# EAGLE design uzed-hmdi-test (EAGLE 8.6.1)

## Sheet 1 of 2
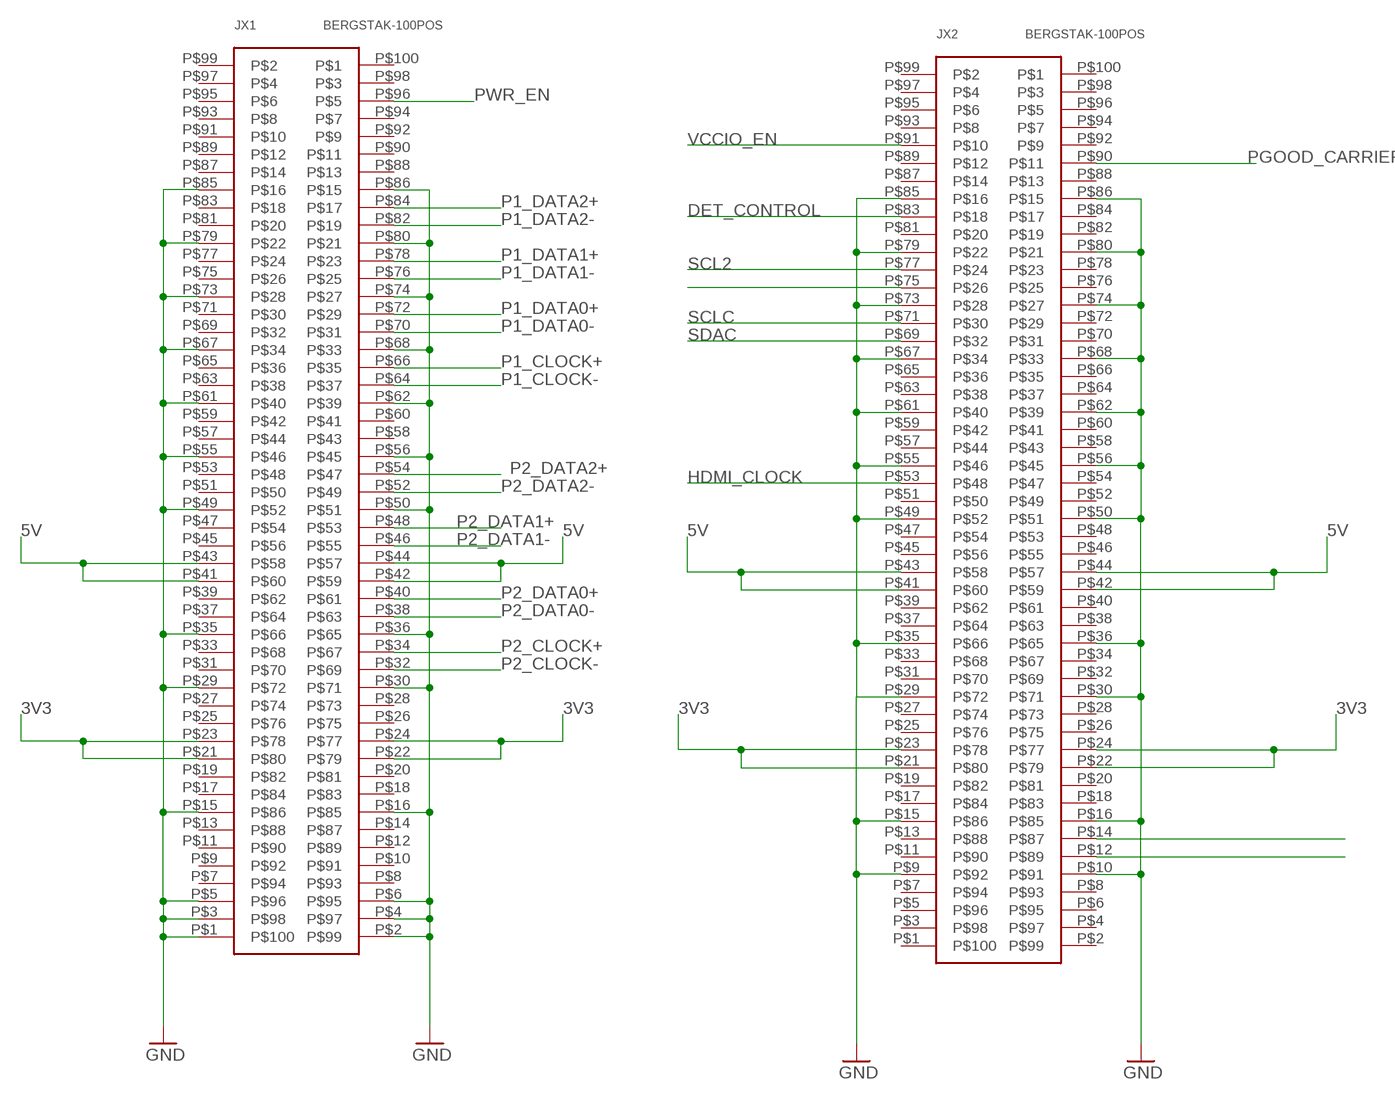
[diagram p0: schematic, sheet 1]

### Parts
JX1  BERGSTAK-100POS  [BERG100POS]
JX2  BERGSTAK-100POS  [BERG100POS]

### Nets
3V3: JX1.P$21 JX1.P$22 JX1.P$23 JX1.P$24 JX2.P$21 JX2.P$22 JX2.P$23 JX2.P$24 ; also sheet 2
5V: JX1.P$41 JX1.P$42 JX1.P$43 JX1.P$44 JX2.P$41 JX2.P$42 JX2.P$43 JX2.P$44 ; also sheet 2
DET_CONTROL: JX2.P$83 ; also sheet 2
GND: JX1.P$1 JX1.P$2 JX1.P$3 JX1.P$4 JX1.P$5 JX1.P$6 JX1.P$15 JX1.P$16 JX1.P$29 JX1.P$30 JX1.P$35 JX1.P$36 JX1.P$49 JX1.P$50 JX1.P$55 JX1.P$56 JX1.P$61 JX1.P$62 JX1.P$67 JX1.P$68 JX1.P$73 JX1.P$74 JX1.P$79 JX1.P$80 JX1.P$85 JX1.P$86 JX2.P$9 JX2.P$10 JX2.P$15 JX2.P$16 JX2.P$29 JX2.P$30 JX2.P$35 JX2.P$36 JX2.P$49 JX2.P$50 JX2.P$55 JX2.P$56 JX2.P$61 JX2.P$62 JX2.P$67 JX2.P$68 JX2.P$73 JX2.P$74 JX2.P$79 JX2.P$80 JX2.P$85 JX2.P$86 ; also sheet 2
HDMI_CLOCK: JX2.P$53 ; also sheet 2
N$2: JX2.P$14
N$3: JX2.P$12
P1_CLOCK+: JX1.P$66 ; also sheet 2
P1_CLOCK-: JX1.P$64 ; also sheet 2
P1_DATA0+: JX1.P$72 ; also sheet 2
P1_DATA0-: JX1.P$70 ; also sheet 2
P1_DATA1+: JX1.P$78 ; also sheet 2
P1_DATA1-: JX1.P$76 ; also sheet 2
P1_DATA2+: JX1.P$84 ; also sheet 2
P1_DATA2-: JX1.P$82 ; also sheet 2
P2_CLOCK+: JX1.P$34 ; also sheet 2
P2_CLOCK-: JX1.P$32 ; also sheet 2
P2_DATA0+: JX1.P$40 ; also sheet 2
P2_DATA0-: JX1.P$38 ; also sheet 2
P2_DATA1+: JX1.P$48 ; also sheet 2
P2_DATA1-: JX1.P$46 ; also sheet 2
P2_DATA2+: JX1.P$54 ; also sheet 2
P2_DATA2-: JX1.P$52 ; also sheet 2
PGOOD_CARRIER: JX2.P$90
PWR_EN: JX1.P$96
SCL2: JX2.P$77 ; also sheet 2
SCLC: JX2.P$71 ; also sheet 2
SDA2: JX2.P$75 ; also sheet 2
SDAC: JX2.P$69 ; also sheet 2
VCCIO_EN: JX2.P$91
Unconnected: JX1.P$7 JX1.P$8 JX1.P$9 JX1.P$10 JX1.P$11 JX1.P$12 JX1.P$13 JX1.P$14 JX1.P$17 JX1.P$18 JX1.P$19 JX1.P$20 JX1.P$25 JX1.P$26 JX1.P$27 JX1.P$28 JX1.P$31 JX1.P$33 JX1.P$37 JX1.P$39 JX1.P$45 JX1.P$47 JX1.P$51 JX1.P$53 JX1.P$57 JX1.P$58 JX1.P$59 JX1.P$60 JX1.P$63 JX1.P$65 JX1.P$69 JX1.P$71 JX1.P$75 JX1.P$77 JX1.P$81 JX1.P$83 JX1.P$87 JX1.P$88 JX1.P$89 JX1.P$90 JX1.P$91 JX1.P$92 JX1.P$93 JX1.P$94 JX1.P$95 JX1.P$97 JX1.P$98 JX1.P$99 JX1.P$100 JX2.P$1 JX2.P$2 JX2.P$3 JX2.P$4 JX2.P$5 JX2.P$6 JX2.P$7 JX2.P$8 JX2.P$11 JX2.P$13 JX2.P$17 JX2.P$18 JX2.P$19 JX2.P$20 JX2.P$25 JX2.P$26 JX2.P$27 JX2.P$28 JX2.P$31 JX2.P$32 JX2.P$33 JX2.P$34 JX2.P$37 JX2.P$38 JX2.P$39 JX2.P$40 JX2.P$45 JX2.P$46 JX2.P$47 JX2.P$48 JX2.P$51 JX2.P$52 JX2.P$54 JX2.P$57 JX2.P$58 JX2.P$59 JX2.P$60 JX2.P$63 JX2.P$64 JX2.P$65 JX2.P$66 JX2.P$70 JX2.P$72 JX2.P$76 JX2.P$78 JX2.P$81 JX2.P$82 JX2.P$84 JX2.P$87 JX2.P$88 JX2.P$89 JX2.P$92 JX2.P$93 JX2.P$94 JX2.P$95 JX2.P$96 JX2.P$97 JX2.P$98 JX2.P$99 JX2.P$100

## Sheet 2 of 2
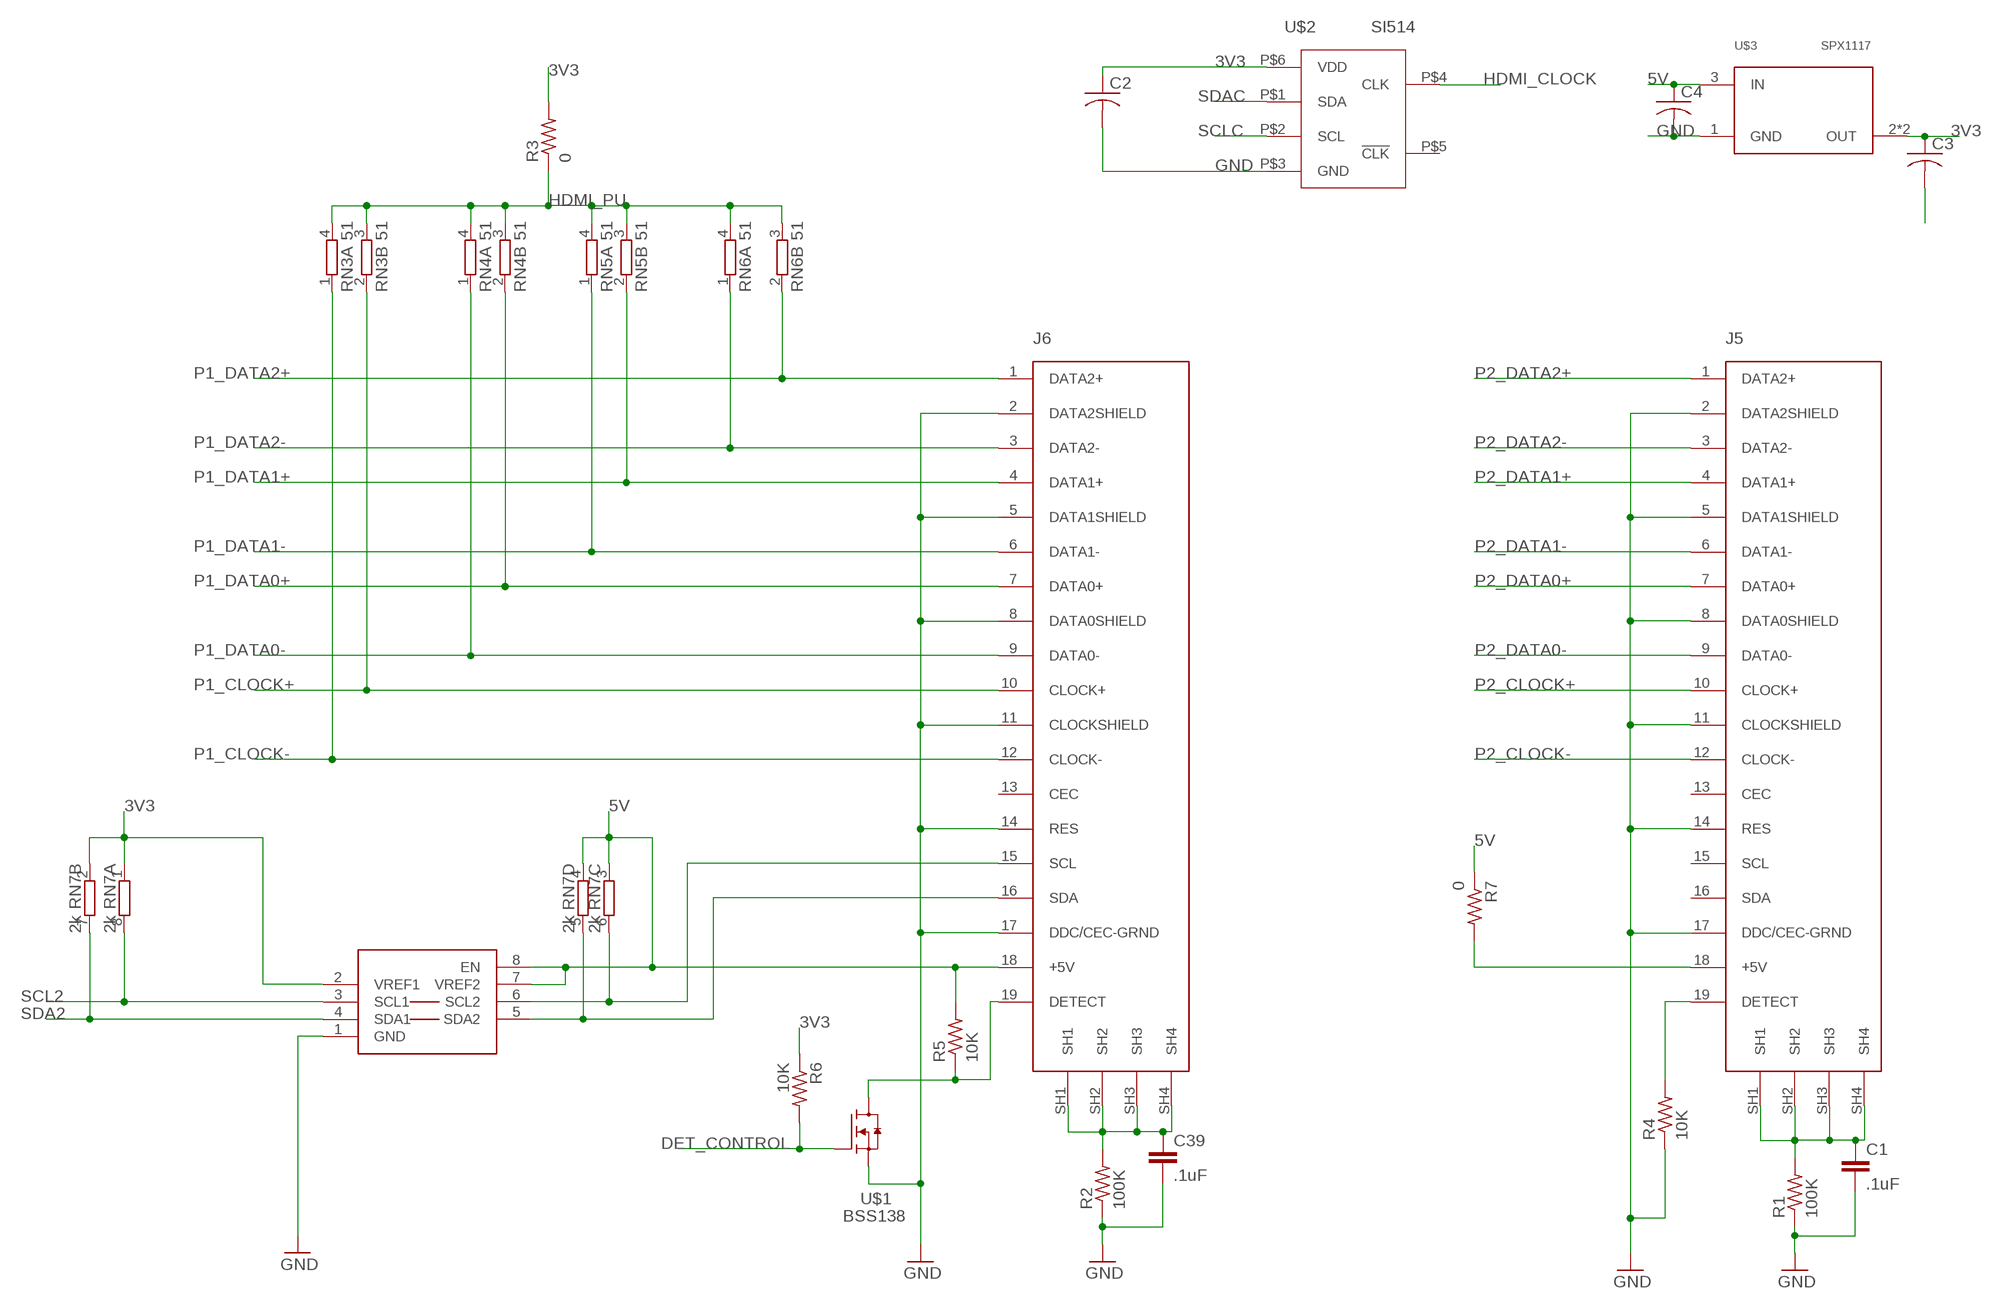
[diagram p1: schematic, sheet 2]

### Parts
C1  .1uF  C-EUC0603K  [C0603K]
C2  C-USC0603  [C0603]
C3  C-USC0603  [C0603]
C4  C-USC0603  [C0603]
C39  .1uF  C-EUC0603K  [C0603K]
J5  HDMI-TYPE-A-RECEPTICALFCI10029449  [FCI-HDMI-TYPE-A-RECEPT]
J6  HDMI-TYPE-A-RECEPTICALFCI10029449  [FCI-HDMI-TYPE-A-RECEPT]
PCA9306  PCA9306  [PSOP-8]
R1  100K  R-US_R0603  [R0603]
R2  100K  R-US_R0603  [R0603]
R3  0  R-US_R0603  [R0603]
R4  10K  R-US_R0603  [R0603]
R5  10K  R-US_R0603  [R0603]
R6  10K  R-US_R0603  [R0603]
R7  0  R-US_R0603  [R0603]
RN3  51  2R-NEXB34V  [EXB34V]
RN4  51  2R-NEXB34V  [EXB34V]
RN5  51  2R-NEXB34V  [EXB34V]
RN6  51  2R-NEXB34V  [EXB34V]
RN7  2k  4R-N0603-ARV  [0603-ARV]
U$1  BSS138  [SOT23]
U$2  SI514  [XTAL-6PIN]
U$3  SPX1117  [SOT223]

### Nets
3V3: C2.1 C3.1 PCA9306.2(VREF1) R3.2 R6.1 RN7.1 RN7.2 U$2.P$6(VDD) U$3.2(OUT) U$3.4(OUT) ; also sheet 1
5V: C4.1 J6.18(+5V) PCA9306.7(VREF2) PCA9306.8(EN) R5.2 R7.1 RN7.3 RN7.4 U$3.3(IN) ; also sheet 1
DET_CONTROL: R6.2 U$1.1(G) ; also sheet 1
GND: C1.2 C2.2 C3.2 C4.2 C39.2 J5.2(DATA2SHIELD) J5.5(DATA1SHIELD) J5.8(DATA0SHIELD) J5.11(CLOCKSHIELD) J5.14(RES) J5.17(DDC/CEC-GRND) J6.2(DATA2SHIELD) J6.5(DATA1SHIELD) J6.8(DATA0SHIELD) J6.11(CLOCKSHIELD) J6.14(RES) J6.17(DDC/CEC-GRND) PCA9306.1(GND) R1.1 R2.1 R4.1 U$1.2(S) U$2.P$3(GND) U$3.1(GND) ; also sheet 1
HDMI_CLOCK: U$2.P$4(CLK) ; also sheet 1
HDMI_PU: R3.1 RN3.3 RN3.4 RN4.3 RN4.4 RN5.3 RN5.4 RN6.3 RN6.4
N$1: C1.1 J5.SH1 J5.SH2 J5.SH3 J5.SH4 R1.2
N$10: J5.19(DETECT) R4.2
N$12: J6.19(DETECT) R5.1 U$1.3(D)
N$14: J5.18(+5V) R7.2
N$15: J6.16(SDA) PCA9306.5(SDA2) RN7.5
N$16: J6.15(SCL) PCA9306.6(SCL2) RN7.6
N$34: C39.1 J6.SH1 J6.SH2 J6.SH3 J6.SH4 R2.2
P1_CLOCK+: J6.10(CLOCK+) RN3.2 ; also sheet 1
P1_CLOCK-: J6.12(CLOCK-) RN3.1 ; also sheet 1
P1_DATA0+: J6.7(DATA0+) RN4.2 ; also sheet 1
P1_DATA0-: J6.9(DATA0-) RN4.1 ; also sheet 1
P1_DATA1+: J6.4(DATA1+) RN5.2 ; also sheet 1
P1_DATA1-: J6.6(DATA1-) RN5.1 ; also sheet 1
P1_DATA2+: J6.1(DATA2+) RN6.2 ; also sheet 1
P1_DATA2-: J6.3(DATA2-) RN6.1 ; also sheet 1
P2_CLOCK+: J5.10(CLOCK+) ; also sheet 1
P2_CLOCK-: J5.12(CLOCK-) ; also sheet 1
P2_DATA0+: J5.7(DATA0+) ; also sheet 1
P2_DATA0-: J5.9(DATA0-) ; also sheet 1
P2_DATA1+: J5.4(DATA1+) ; also sheet 1
P2_DATA1-: J5.6(DATA1-) ; also sheet 1
P2_DATA2+: J5.1(DATA2+) ; also sheet 1
P2_DATA2-: J5.3(DATA2-) ; also sheet 1
SCL2: PCA9306.3(SCL1) RN7.8 ; also sheet 1
SCLC: U$2.P$2(SCL) ; also sheet 1
SDA2: PCA9306.4(SDA1) RN7.7 ; also sheet 1
SDAC: U$2.P$1(SDA) ; also sheet 1
Unconnected: J5.13(CEC) J5.15(SCL) J5.16(SDA) J6.13(CEC) U$2.P$5(!CLK)

## Library data of the parts
C1 C39 = rcl:C-EU: CAPACITOR, European symbol
C2-C4 = rcl:C-US: CAPACITOR, American symbol; SPICEPREFIX: C
J5 J6 = saanlima:HDMI-TYPE-A-RECEPTICAL
JX1 JX2 = lupa300-components:BERGSTAK-100POS
PCA9306 = saanlima:PCA9306
R1 R2 R4-R7 = rcl:R-US_: RESISTOR, American symbol
R3 = rcl:R-US_: RESISTOR, American symbol; SPICEPREFIX: R
RN3-RN6 = resistor-dil:2R-N: Array Chip Resistor Source: Panasonic; OC_FARNELL: unknown; OC_NEWARK: unknown
RN7 = resistor-dil:4R-N: Array Chip Resistor Source: RS Component / Phycomp; OC_FARNELL: unknown; OC_NEWARK: unknown
U$1 = lupa300-components:BSS138: N-Channel 50V 220mA (Ta) 360mW (Ta) Surface Mount SOT-23-3
U$2 = lupa300-components:SI514
U$3 = lupa300-components:SPX1117: IC REG LINEAR 3.3V 800MA SOT223

## Board
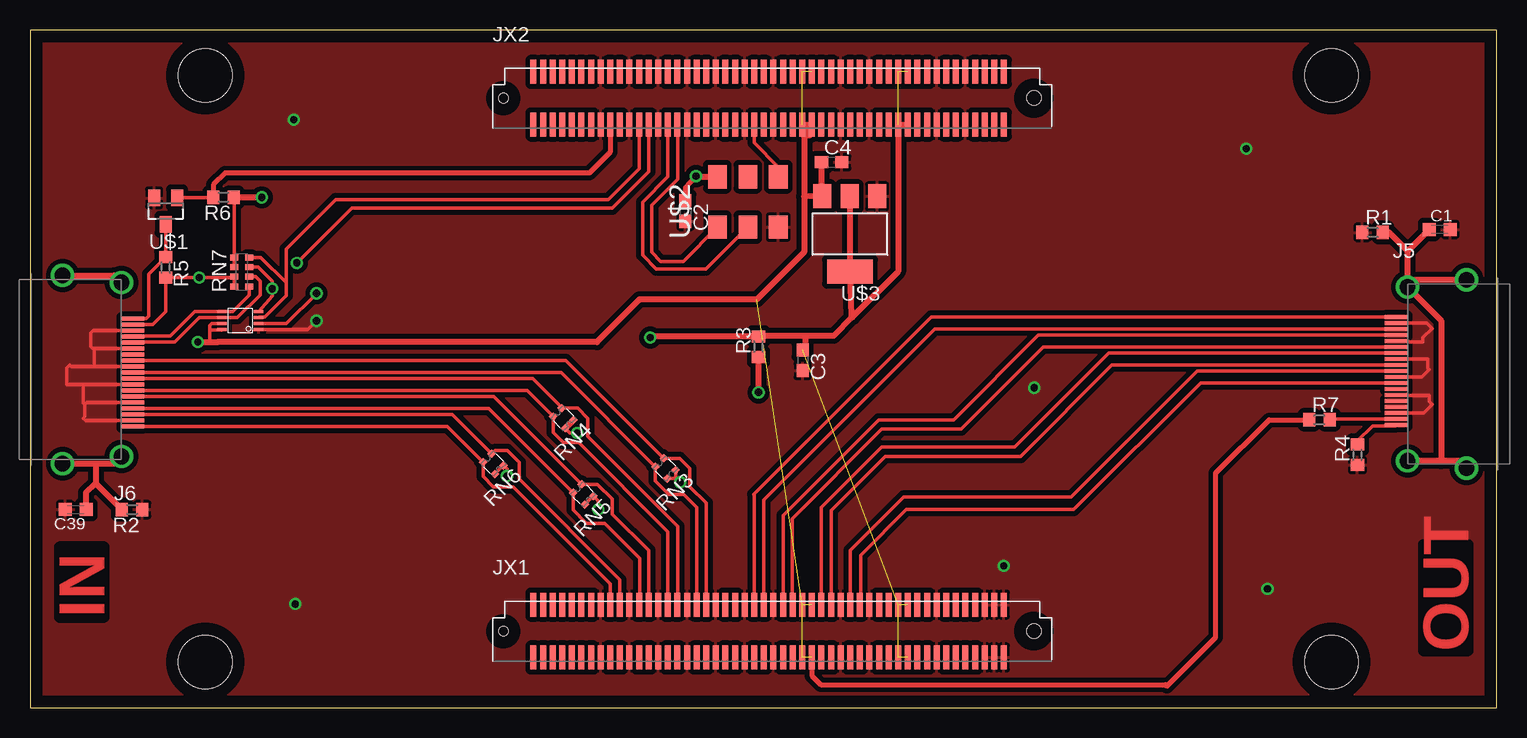
[diagram p2: board, top side]
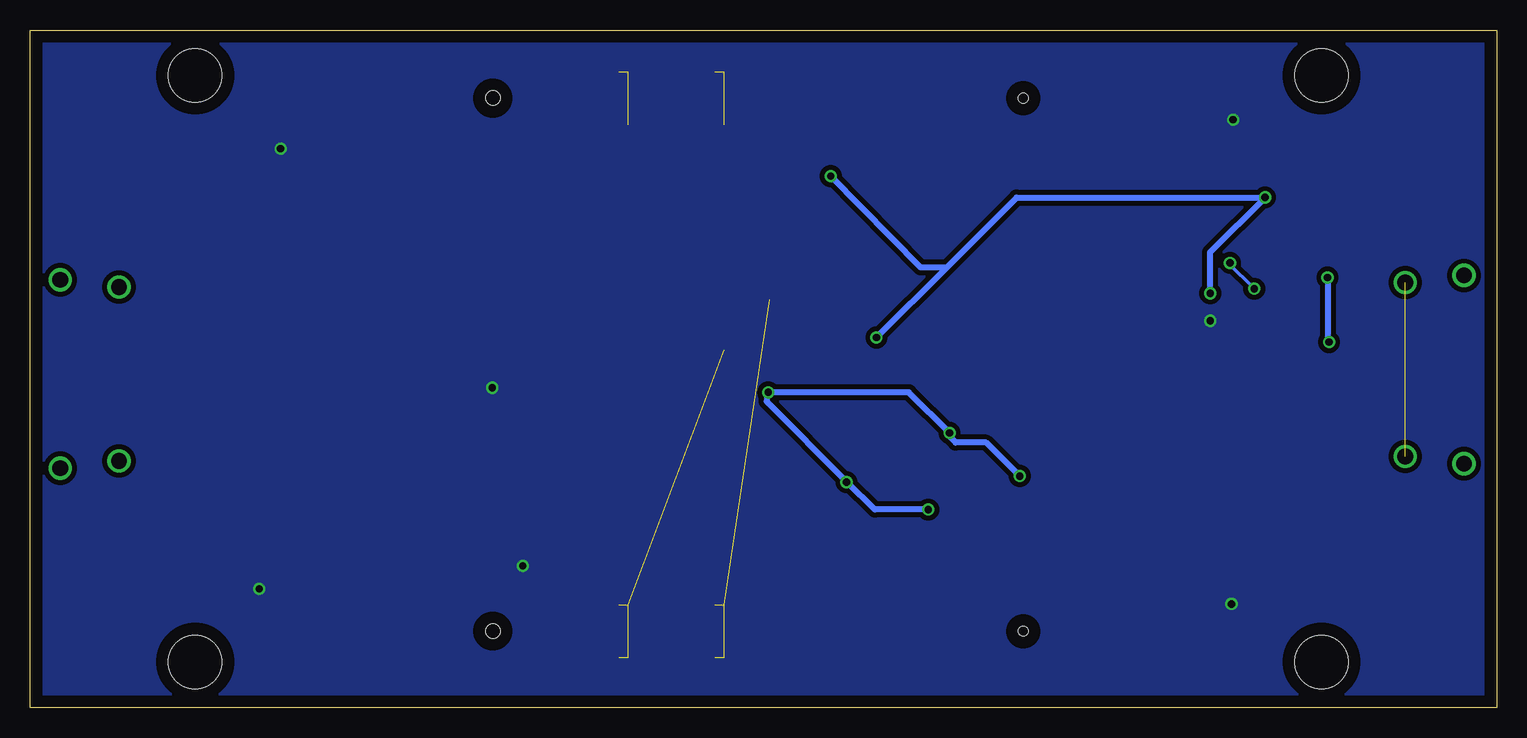
[diagram p3: board, bottom side, seen from below]

Size 122.22 x 56.51 mm. Coordinates in mm from the lower left corner, seen from the top.
Outline: 0,0 122.22,0 122.22,56.51 0,56.51 0,0
Copper layers (1*16): Top 0.035mm / dielectric 1.5mm / Bottom 0.035mm
Design rules "default": minimum track width 6mil, minimum drill 0.35mm, track to track 6mil, track to pad 6mil, pad to pad 6mil, via to via 6mil, smd to smd 6mil, copper to edge 40mil, drill to drill 6mil, minimum pad ring 10mil, minimum via ring 8mil, stop-mask expansion 4mil, vias tented up to drill 0mil, thermal gap 10mil
Holes 4.45 mm at 14.61,3.81 14.61,52.7 108.46,3.81 108.46,52.7

### Footprints (pad centres in the part's own frame; a part is rotated, then mirrored left to right if it is on the bottom)
C0603K = smd 1.05 x 1.08: 1 -0.875,0; 2 0.875,0
C0603 = smd 1.1 x 1: 1 -0.85,0; 2 0.85,0
FCI-HDMI-TYPE-A-RECEPT = smd 1.9 x 0.3: 1 -0.95,4.5; 2 -0.95,4; 3 -0.95,3.5; 4 -0.95,3; 5 -0.95,2.5; 6 -0.95,2; 7 -0.95,1.5; 8 -0.95,1; 9 -0.95,0.5; 10 -0.95,0; 11 -0.95,-0.5; 12 -0.95,-1; 13 -0.95,-1.5; 14 -0.95,-2; 15 -0.95,-2.5; 16 -0.95,-3; 17 -0.95,-3.5; 18 -0.95,-4; 19 -0.95,-4.5 | drill 1.3: SH1 4.9,7.6; SH2 0,7; SH3 0,-7.5; SH4 4.9,-8.1
BERG100POS = smd 0.5 x 2: P$1 0,1; P$2 0,5.4; P$3 -0.8,1; P$4 -0.8,5.4; P$5 -1.6,1; P$6 -1.6,5.4; P$7 -2.4,1; P$8 -2.4,5.4; P$9 -3.2,1; P$10 -3.2,5.4; P$11 -4,1; P$12 -4,5.4; P$13 -4.8,1; P$14 -4.8,5.4; P$15 -5.6,1; P$16 -5.6,5.4; P$17 -6.4,1; P$18 -6.4,5.4; P$19 -7.2,1; P$20 -7.2,5.4; P$21 -8,1; P$22 -8,5.4; P$23 -8.8,1; P$24 -8.8,5.4; P$25 -9.6,1; P$26 -9.6,5.4; P$27 -10.4,1; P$28 -10.4,5.4; P$29 -11.2,1; P$30 -11.2,5.4; P$31 -12,1; P$32 -12,5.4; P$33 -12.8,1; P$34 -12.8,5.4; P$35 -13.6,1; P$36 -13.6,5.4; P$37 -14.4,1; P$38 -14.4,5.4; P$39 -15.2,1; P$40 -15.2,5.4; P$41 -16,1; P$42 -16,5.4; P$43 -16.8,1; P$44 -16.8,5.4; P$45 -17.6,1; P$46 -17.6,5.4; P$47 -18.4,1; P$48 -18.4,5.4; P$49 -19.2,1; P$50 -19.2,5.4; P$51 -20,1; P$52 -20,5.4; P$53 -20.8,1; P$54 -20.8,5.4; P$55 -21.6,1; P$56 -21.6,5.4; P$57 -22.4,1; P$58 -22.4,5.4; P$59 -23.2,1; P$60 -23.2,5.4; P$61 -24,1; P$62 -24,5.4; P$63 -24.8,1; P$64 -24.8,5.4; P$65 -25.6,1; P$66 -25.6,5.4; P$67 -26.4,1; P$68 -26.4,5.4; P$69 -27.2,1; P$70 -27.2,5.4; P$71 -28,1; P$72 -28,5.4; P$73 -28.8,1; P$74 -28.8,5.4; P$75 -29.6,1; P$76 -29.6,5.4; P$77 -30.4,1; P$78 -30.4,5.4; P$79 -31.2,1; P$80 -31.2,5.4; P$81 -32,1; P$82 -32,5.4; P$83 -32.8,1; P$84 -32.8,5.4; P$85 -33.6,1; P$86 -33.6,5.4; P$87 -34.4,1; P$88 -34.4,5.4; P$89 -35.2,1; P$90 -35.2,5.4; P$91 -36,1; P$92 -36,5.4; P$93 -36.8,1; P$94 -36.8,5.4; P$95 -37.6,1; P$96 -37.6,5.4; P$97 -38.4,1; P$98 -38.4,5.4; P$99 -39.2,1; P$100 -39.2,5.4 | hole 0.8: -41.7,3.2 | hole 1.2: 2.5,3.2
PSOP-8 = smd 0.25 x 0.8: 1 -0.73,-1.52; 2 -0.23,-1.52; 3 0.27,-1.52; 4 0.77,-1.52; 5 0.77,1.53; 6 0.27,1.53; 7 -0.23,1.53; 8 -0.73,1.53
R0603 = smd 1 x 1.1: 1 -0.85,0; 2 0.85,0
EXB34V = smd 0.5 x 0.5: 1 -0.5,-0.7; 2 0.5,-0.7; 3 0.5,0.7; 4 -0.5,0.7
0603-ARV = smd 0.5 x 0.65: 1 -1.2,-0.625; 2 -0.4,-0.625; 3 0.4,-0.625; 4 1.2,-0.625; 5 1.2,0.625; 6 0.4,0.625; 7 -0.4,0.625; 8 -1.2,0.625
SOT23 = smd 1 x 1.4: 1 -0.95,-1.1; 2 0.95,-1.1; 3 0,1.1
XTAL-6PIN = smd 1.95 x 1.55: P$1 -2.1,2.54; P$2 -2.1,0; P$3 -2.1,-2.54; P$4 2.1,-2.54; P$5 2.1,0; P$6 2.1,2.54
SOT223 = smd 1.499 x 2.007: 1 -2.261,-3.15; 2 0.025,-3.15; 3 2.311,-3.15 | smd 3.81 x 2.007: 4 0,3.15

### Placement (x,y rotation side)
C1  117.47,39.88 0 top
C2  54.61,41.4 270 top
C3  64.39,28.96 270 top
C4  66.8,45.47 0 top
C39  3.81,16.51 180 top
J5  114.81,28.07 0 top
J6  7.62,27.94 180 top
JX1  81.15,3.17 0 top
JX2  81.15,47.62 0 top
PCA9306  17.53,32.26 90 top
R1  111.89,39.62 0 top
R2  8.51,16.51 180 top
R3  60.71,30.1 90 top
R4  110.62,21.08 90 top
R5  11.3,36.7 270 top
R6  16.13,42.55 180 top
R7  107.44,24 0 top
RN3  52.96,19.94 225 top
RN4  44.45,24.13 225 top
RN5  46.1,17.78 225 top
RN6  38.61,20.32 225 top
RN7  17.65,36.32 270 top
U$1  11.3,41.4 180 top
U$2  59.82,42.16 90 top
U$3  68.33,39.5 180 top

### Tracks (layer width: path | path; a pad name or v marks a point on that pad's centre or on a via)
3V3  (via drill 0.6 pad 0.8)  (6 unrouted)
  Top 0.305: R6.1 17.03,42.5 RN7.1 RN7.2 | v23.88,34.54 21.36,32.03 PCA9306.2
  Top 0.406: v55.5,44.32 54.61,43.35 C2.1
  Top 0.508: JX2.P$21 JX2.P$23 72.35,36.37 68.54,32.56 | 68.54,32.56 66.97,30.99 64.64,30.99 | 64.64,30.99 60.58,30.99 R3.2 51.78,30.95 v51.69,30.86 | v19.3,42.55 17.08,42.55 17.03,42.5 | v55.5,44.32 55.57,44.26 U$2.P$6 | 68.54,32.56 68.45,32.64 U$3.4 68.33,42.62 U$3.2 | C3.1 64.64,30.06 64.64,30.99
  Bottom 0.508: v51.69,30.86 45.85,36.7 | 45.85,36.7 40.01,42.55 v19.3,42.55 23.88,37.97 v23.88,34.54 | 45.85,36.7 48.01,36.7 v55.5,44.32
5V  (via drill 0.6 pad 0.8)  (6 unrouted)
  Top 0.305: J6.18 10.22,31.94 11.3,33.02 R5.2 v14.1,35.85 16.96,35.85 RN7.3 RN7.4 | PCA9306.7 15.14,32.03 14.99,31.88 14.99,31.5 | 14.99,31.5 14.99,30.48 15.62,30.48 | PCA9306.8 15.96,31.5 14.99,31.5
  Top 0.406: JX1.P$41 65.15,2.67 65.91,1.91 94.61,1.91 94.74,1.78 98.81,5.84 98.81,19.56 103.25,24 R7.1
  Top 0.508: 64.52,42.62 64.52,47.62 64.97,47.71 64.34,48.61 JX2.P$43 JX2.P$41 | 64.52,42.62 64.52,37.97 60.58,34.04 50.79,34.04 47.23,30.48 15.62,30.48 v13.97,30.48 | 64.52,42.62 U$3.3 65.95,42.71 C4.1
  Bottom 0.508: v14.1,35.85 14.1,30.48 v13.97,30.48
DET_CONTROL
  Top 0.305: U$1.1 12.3,42.55 R6.2
  Top 0.406: JX2.P$83 48.35,46.32 46.61,44.58 16.26,44.58 15.28,43.6 R6.2
GND  (via drill 0.6 pad 0.8)
  Top 0.305: J5.2 116.4,32.07 116.84,31.62 116.08,30.86 116.08,30.48 114.98,30.48 114.93,30.52 113.9,30.52 J5.5 | J5.17 116.13,24.57 116.84,25.27 116.59,25.53 116.59,26.04 113.89,26.04 J5.14 | J5.11 115.96,27.57 116.59,28.19 116.46,28.32 116.46,29.08 113.87,29.08 J5.8 | J6.17 5.28,31.44 5.08,31.24 5.08,30.1 5.24,29.94 | J6.14 5.24,29.94 | 5.24,29.94 5.33,29.84 5.33,28.57 5.47,28.44 J6.11 3.44,28.44 3.3,28.57 3.05,28.32 3.05,26.92 4.45,26.92 | 4.45,26.92 8.55,26.92 J6.8 | 4.57,25.27 4.74,25.44 J6.5 | 4.57,25.27 4.45,25.4 4.45,26.92 | J6.2 4.63,23.94 4.45,24.13 4.57,24.26 4.57,25.27 | v23.88,32.26 23.15,31.53 PCA9306.1
  other vias: 83.69,26.67 81.15,11.81 103.12,9.91 101.35,46.61 22.1,8.64 21.97,49.02
  pour Top (isolate 0.406): -1.4,56.52 122.56,56.52 122.56,-0.64 -1.4,-0.64
  pour Bottom (isolate 0.406): -1.4,56.39 122.3,56.39 122.3,0 -1.4,0
HDMI_CLOCK
  Top 0.305: JX2.P$53 60.35,47.09 62.36,45.09 U$2.P$4
HDMI_PU  (via drill 0.6 pad 0.8)
  Top 0.305: RN6.3 RN6.4 39.75,19.88 v39.75,19.3 | RN5.3 RN5.4 47.37,17.22 v47.37,16.51 | RN3.3 53.89,19.09 v54.18,18.8 53.81,19.17 RN3.4 | v45.59,22.91 44.97,22.91 RN4.3
  Top 0.508: RN4.4 RN4.3 | R3.1 v60.71,26.29
  Bottom 0.305: 54.1,18.8 v54.18,18.8 | 45.72,22.73 45.59,22.86 v45.59,22.91 | v60.71,26.29 60.83,26.29
  Bottom 0.508: v39.75,19.3 42.55,22.1 45.09,22.1 45.72,22.73 | v47.37,16.51 51.82,16.51 54.1,18.8 60.83,25.53 60.83,26.29 | v45.59,22.91 48.98,26.29 v60.71,26.29
N$1
  Top 0.508: J5.SH2 114.81,38.09 | 114.81,38.09 C1.1 | 114.81,38.09 113.27,39.62 R1.2 | J5.SH4 119.11,20.57 117.6,20.57 | 117.6,20.57 J5.SH3 | J5.SH1 115.41,35.67 J5.SH2 | J5.SH2 117.6,32.27 117.6,20.57
N$10
  Top 0.305: J5.19 113.79,23.5 111.89,23.5 110.62,22.23 R4.2
N$12
  Top 0.305: U$1.3 R5.1 9.91,36.16 9.91,32.64 9.71,32.44 J6.19
N$14
  Top 0.305: R7.2 108.36,24.07 J5.18
N$15
  Top 0.305: J6.16 8.61,30.98 9.64,30.98 9.65,30.99 11.68,30.99 13.72,33.03 PCA9306.5 16.88,33.03 16.89,33.02 18.28,34.41 RN7.5
N$16
  Top 0.305: J6.15 8.61,30.48 12.06,30.48 14.11,32.53 PCA9306.6 17.29,32.53 19.18,34.42 19.18,35.56 18.82,35.92 RN7.6
N$34  (1 unrouted)
  Top 0.508: J6.SH4 7.02,36.04 J6.SH3 | J6.SH1 5.46,20.34 | 5.46,20.34 7.02,20.34 J6.SH2 | 5.46,20.34 5.46,18.71 | 5.46,18.71 R2.2 | C39.1 4.68,17.93 5.46,18.71
P1_CLOCK+
  Top 0.305: J6.10 44.25,27.94 RN3.2 52.11,18.88 52.64,18.35 53.21,17.78 54.48,17.78 55.55,16.71 JX1.P$66
P1_CLOCK-
  Top 0.305: JX1.P$64 56.35,17.05 54.99,18.41 54.99,19.94 54.14,20.79 RN3.1 44.66,28.94 J6.12
P1_DATA0+
  Top 0.305: J6.7 41.43,26.44 RN4.2 43.6,22.95 44.45,22.1 45.72,22.1 53.15,14.66 JX1.P$72
P1_DATA0-
  Top 0.305: J6.9 41.91,27.43 44.31,25.03 RN4.1 45.63,24.98 46.48,24.13 46.48,22.61 53.98,15.11 53.98,8.6 JX1.P$70
P1_DATA1+
  Top 0.305: J6.4 38.23,24.94 RN5.2 45.25,16.47 46.35,15.37 47.88,15.37 50.8,12.45 50.8,8.62 JX1.P$78
P1_DATA1-
  Top 0.305: J6.6 38.65,25.94 RN5.1 47.28,18.63 48.51,17.4 48.51,16.13 51.55,13.09 JX1.P$76
P1_DATA2+
  Top 0.305: J6.1 34.78,23.44 RN6.2 37.76,19.26 38.61,18.41 40.26,18.41 48.35,10.32 JX1.P$84
P1_DATA2-
  Top 0.305: J6.3 35.2,24.44 RN6.1 38.76,21.46 39.75,21.46 40.77,20.45 40.77,19.05 49.15,10.66 JX1.P$82
P2_CLOCK+
  Top 0.305: JX1.P$34 68.35,13.11 72.8,17.55 86.77,17.55 97.28,28.07 J5.10
P2_CLOCK-
  Top 0.305: J5.12 97.55,27.07 87,16.51 73.03,16.51 69.22,12.7 69.22,8.64 JX1.P$32
P2_DATA0+
  Top 0.305: J5.7 89.89,29.57 82.04,21.72 70.99,21.72 65.95,16.68 JX1.P$40
P2_DATA0-
  Top 0.305: J5.9 90.16,28.57 82.55,20.95 71.28,20.95 66.75,16.43 JX1.P$38
P2_DATA1+
  Top 0.305: J5.4 84.03,31.07 76.96,24 70.74,24 62.75,16.02 JX1.P$48
P2_DATA1-
  Top 0.305: J5.6 84.42,30.07 77.6,23.24 70.99,23.24 63.5,15.75 63.5,8.63 JX1.P$46
P2_DATA2+
  Top 0.305: J5.1 75.11,32.57 60.33,17.78 60.35,17.75 JX1.P$54
P2_DATA2-
  Top 0.305: J5.3 75.38,31.57 61.15,17.34 JX1.P$52
SCL2
  Top 0.305: PCA9306.3 19.09,32.57 19.55,32.57 21.34,34.36 21.34,35.43 | 21.34,35.43 19.25,37.52 RN7.8 | 21.34,35.43 21.34,38.23 25.48,42.37 48.17,42.37 50.76,44.96 50.76,48.25 JX2.P$77
SCLC
  Top 0.305: U$2.P$2 56.33,36.58 52.2,36.58 51.05,37.72 51.05,42.16 53.15,44.26 JX2.P$71
SDA2  (via drill 0.6 pad 0.8)
  Top 0.305: PCA9306.4 20.19,34.3 v20.19,34.92 20.19,35.56 19.03,36.72 RN7.7 | v22.23,37.08 26.8,41.66 48.51,41.66 51.55,44.7 JX2.P$75
  Bottom 0.305: v20.19,34.92 22.35,37.08 v22.23,37.08
SDAC
  Top 0.305: U$2.P$1 54.42,37.21 52.58,37.21 51.82,37.97 51.82,41.91 53.98,44.07 53.98,48.6 JX2.P$69

### Text on the board
Top: IN | OUT